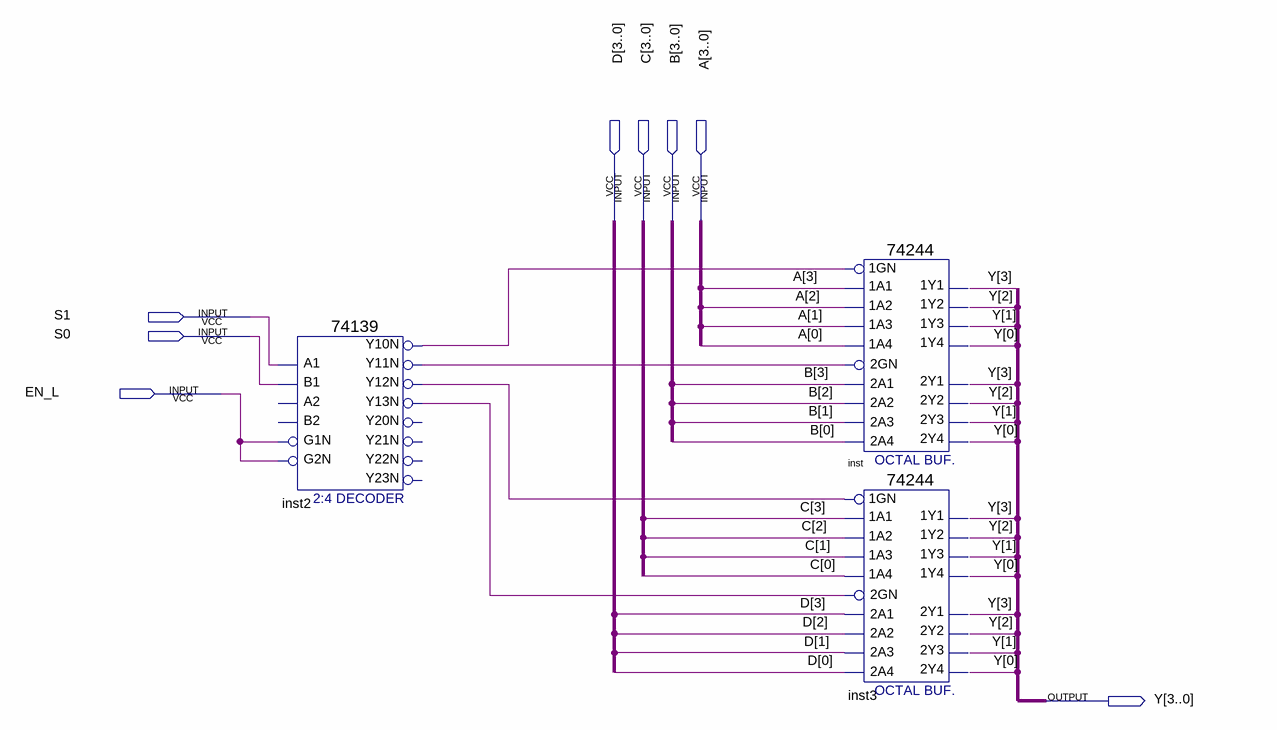
[diagram p0: schematic sheet]
// Quartus schematic Desafio.bdf as structural Verilog: 3 symbols, 8 pins
module Desafio (
  input  [3:0] D,
  input  [3:0] C,
  input  [3:0] B,
  input  [3:0] A,
  input  S1,
  input  S0,
  input  EN_L,
  output [3:0] Y
);

  wire inst2_y10n, inst2_y11n, inst2_y12n, inst2_y13n;

  \74139  inst2 (
    .A1(S1), .B1(S0), .G1N(EN_L), .G2N(EN_L), .Y10N(inst2_y10n), .Y13N(inst2_y13n), .Y12N(inst2_y12n),
    .Y11N(inst2_y11n));  // open: A2, B2, Y20N, Y21N, Y22N, Y23N
  \74244  inst (
    .\1A2 (A[2]), .\1A4 (A[0]), .\1A1 (A[3]), .\1A3 (A[1]), .\1GN (inst2_y10n), .\2A3 (B[1]),
    .\2GN (inst2_y11n), .\2A1 (B[3]), .\2A4 (B[0]), .\2A2 (B[2]), .\1Y2 (Y[2]), .\1Y4 (Y[0]), .\2Y1 (Y[3]),
    .\1Y1 (Y[3]), .\2Y3 (Y[1]), .\2Y4 (Y[0]), .\1Y3 (Y[1]), .\2Y2 (Y[2]));
  \74244  inst3 (
    .\1A2 (C[2]), .\1A4 (C[0]), .\1A1 (C[3]), .\1A3 (C[1]), .\1GN (inst2_y12n), .\2A3 (D[1]),
    .\2GN (inst2_y13n), .\2A1 (D[3]), .\2A4 (D[0]), .\2A2 (D[2]), .\1Y2 (Y[2]), .\1Y4 (Y[0]), .\2Y1 (Y[3]),
    .\1Y1 (Y[3]), .\2Y3 (Y[1]), .\2Y4 (Y[0]), .\1Y3 (Y[1]), .\2Y2 (Y[2]));
endmodule
